# Altium schematic sheet CONNECTORS.SchDoc
size A3; Organization: Electronic Research & Design; Address1: 11 Granofier; Address2: Zwartkop; Address3: Centurion; Address4: South Africa; ProjectName: Flir
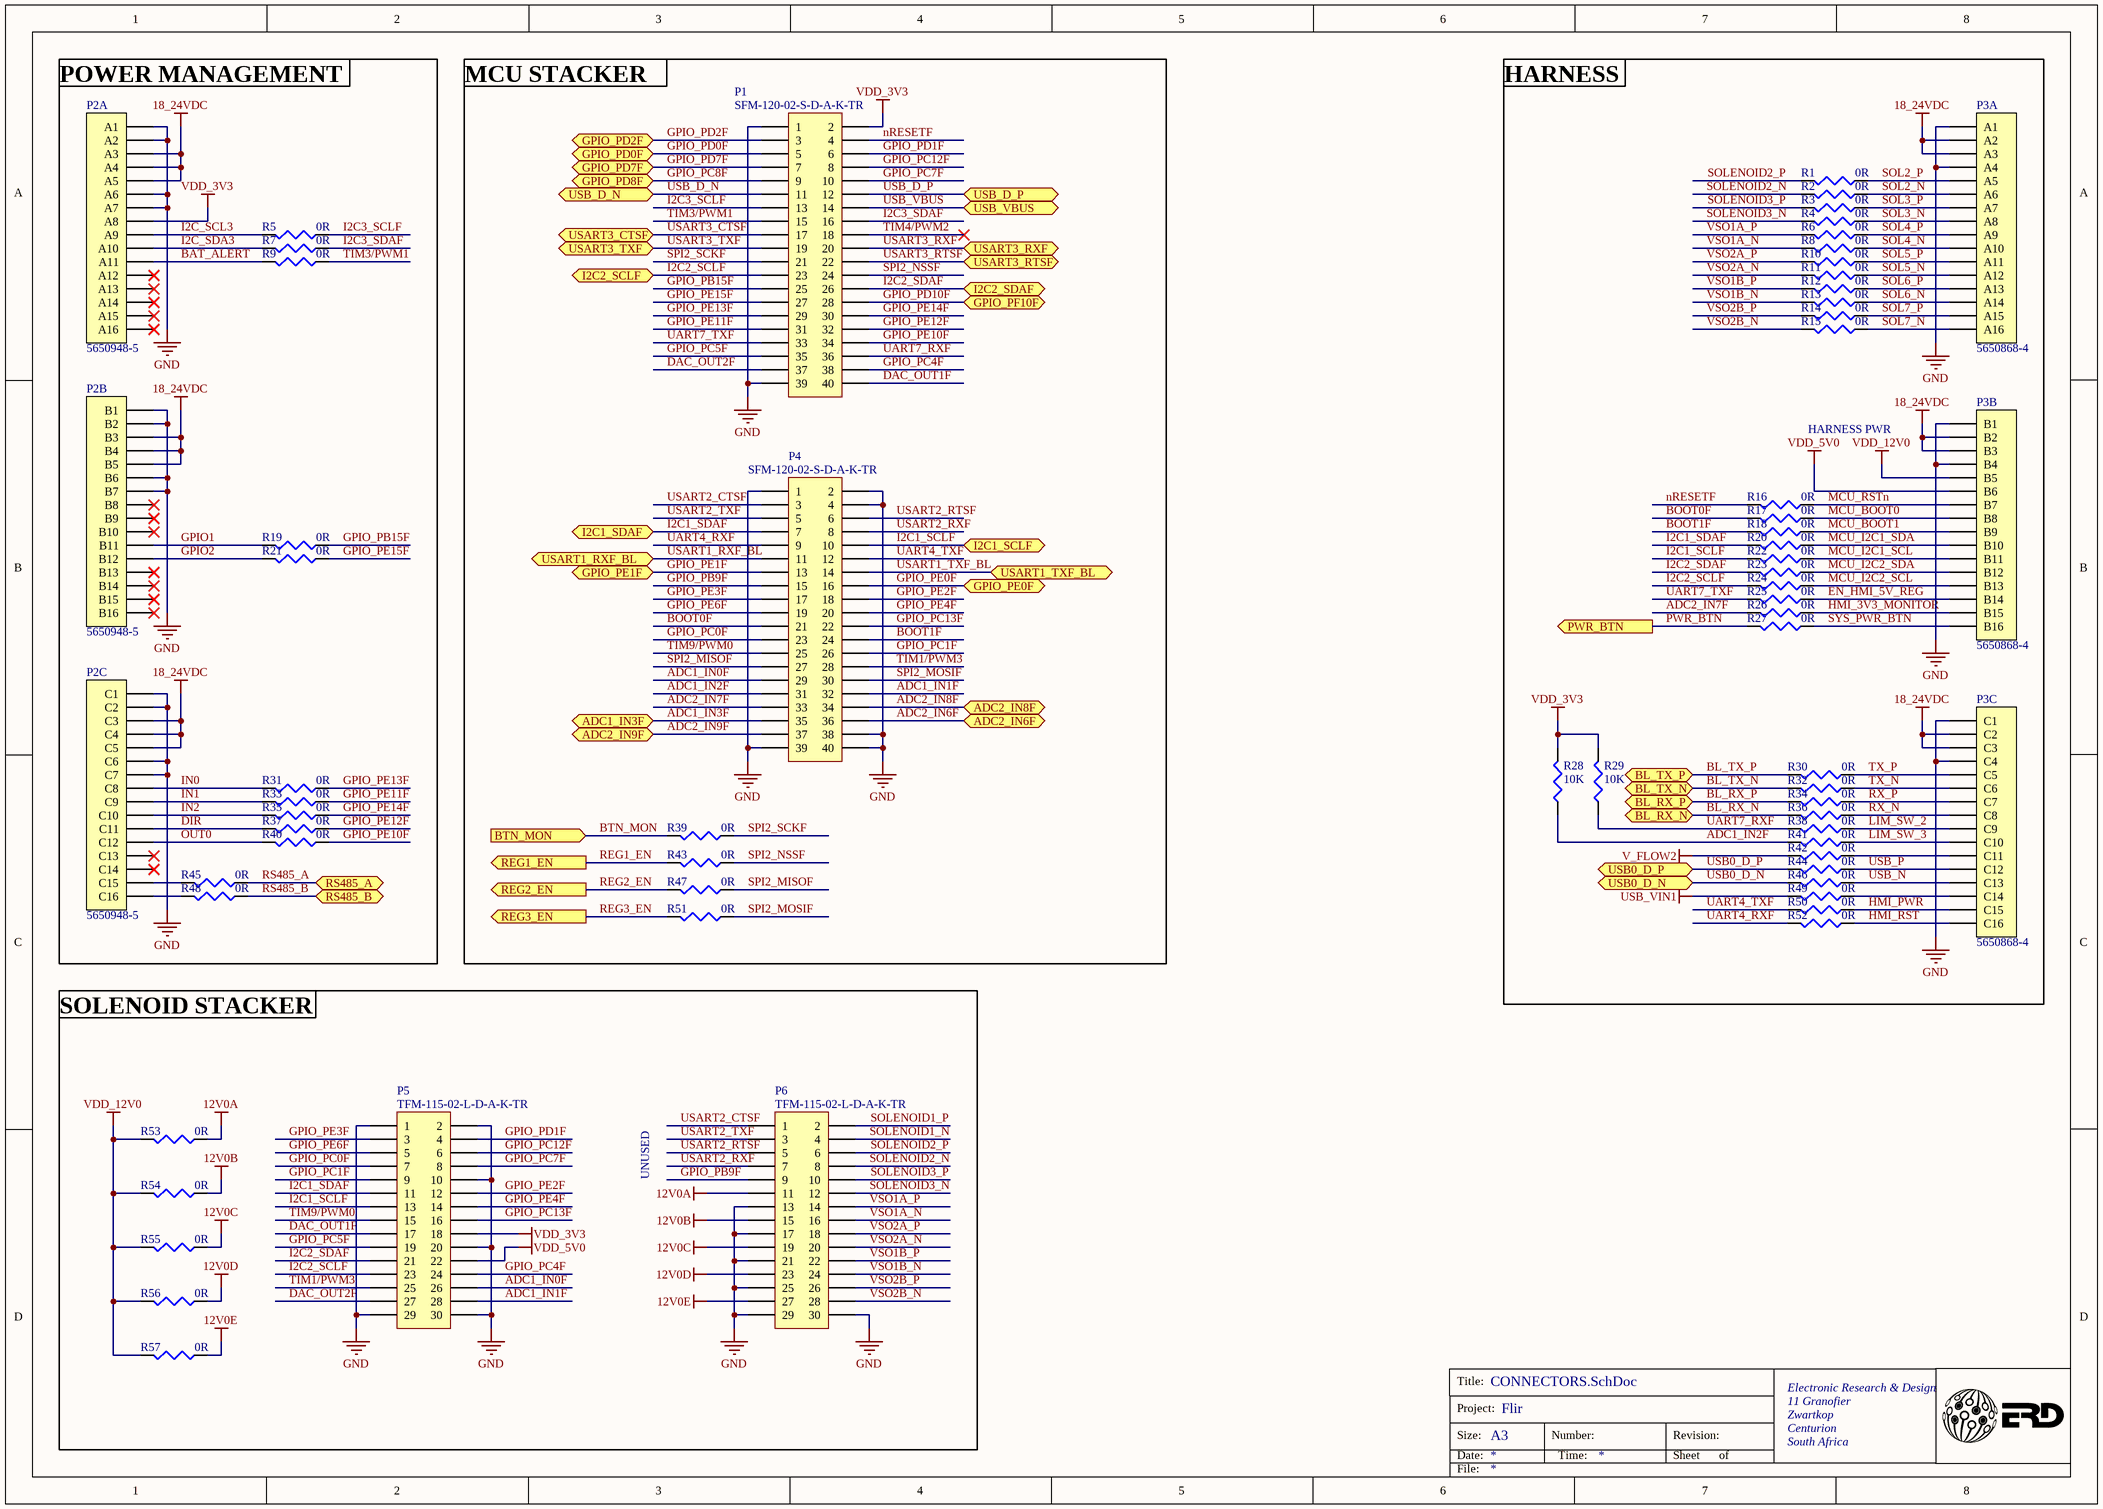
[diagram p0: CONNECTORS.SchDoc]

## Parts
P1  SFM-120-02-S-D-A-K-TR  [SFM-120-02-S-D-A-K-TR]
P2  5650948-5  [5650948-5_M_RA]  (parts A,B,C of 3)
P3  5650868-4  [5650868-4_F_RA]  (parts A,B,C of 3)
P4  SFM-120-02-S-D-A-K-TR  [SFM-120-02-S-D-A-K-TR]
P5  TFM-115-02-L-D-A-K-TR  [SFM-115-02-L-D-A-K-TR]
P6  TFM-115-02-L-D-A-K-TR  [SFM-115-02-L-D-A-K-TR]
R1  0R  [RC0402]
R2  0R  [RC0402]
R3  0R  [RC0402]
R4  0R  [RC0402]
R5  0R  [RC0402]
R6  0R  [RC0402]
R7  0R  [RC0402]
R8  0R  [RC0402]
R9  0R  [RC0402]
R10  0R  [RC0402]
R11  0R  [RC0402]
R12  0R  [RC0402]
R13  0R  [RC0402]
R14  0R  [RC0402]
R15  0R  [RC0402]
R16  0R  [RC0402]
R17  0R  [RC0402]
R18  0R  [RC0402]
R19  0R  [RC0402]
R20  0R  [RC0402]
R21  0R  [RC0402]
R22  0R  [RC0402]
R23  0R  [RC0402]
R24  0R  [RC0402]
R25  0R  [RC0402]
R26  0R  [RC0402]
R27  0R  [RC0402]
R28  10K  [RC0402]
R29  10K  [RC0402]
R30  0R  [RC0402]
R31  0R  [RC0402]
R32  0R  [RC0402]
R33  0R  [RC0402]
R34  0R  [RC0402]
R35  0R  [RC0402]
R36  0R  [RC0402]
R37  0R  [RC0402]
R38  0R  [RC0402]
R39  0R  [RC0402]
R40  0R  [RC0402]
R41  0R  [RC0402]
R42  0R  [RC0402]
R43  0R  [RC0402]
R44  0R  [RC0402]
R45  0R  [RC0402]
R46  0R  [RC0402]
R47  0R  [RC0402]
R48  0R  [RC0402]
R49  0R  [RC0402]
R50  0R  [RC0402]
R51  0R  [RC0402]
R52  0R  [RC0402]
R53  0R  [RC0603]
R54  0R  [RC0603]
R55  0R  [RC0603]
R56  0R  [RC0603]
R57  0R  [RC0603]

## Blocks framed on the sheet
HARNESS PWR: P3 R1-R4 R6 R8 R10-R18 R20 R22-R30 R32 R34 R36 R38 R41 R42 R44 R46 R49 R50 R52
UNUSED: P5 P6 R53-R57

## Ports
ADC1_IN3F, ADC2_IN6F, ADC2_IN8F, ADC2_IN9F, BL_RX_N (bidir), BL_RX_P (bidir), BL_TX_N (bidir), BL_TX_P (bidir), BTN_MON (in), GPIO_PD0F, GPIO_PD2F, GPIO_PD7F, GPIO_PD8F, GPIO_PE0F, GPIO_PE1F, GPIO_PF10F, I2C1_SCLF, I2C1_SDAF, I2C2_SCLF, I2C2_SDAF, PWR_BTN (out), REG1_EN (out), REG2_EN (out), REG3_EN (out), RS485_A (bidir), RS485_B (bidir), USART1_RXF_BL, USART1_TXF_BL, USART3_CTSF, USART3_RTSF, USART3_RXF, USART3_TXF, USB0_D_N (bidir), USB0_D_P (bidir), USB_D_N (bidir), USB_D_P (bidir), USB_VBUS (bidir)

## Nets
12V0A: P6.11 R53.1
12V0B: P6.15 R54.1
12V0C: P6.19 R55.1
12V0D: P6.23 R56.1
12V0E: P6.27 R57.1
18_24VDC: P2.3(A3) P2.4(A4) P2.5(A5) P2.19(B3) P2.20(B4) P2.21(B5) P2.35(C3) P2.36(C4) P2.37(C5) P3.2(A2) P3.3(A3) P3.18(B2) P3.19(B3) P3.34(C2) P3.35(C3)
GND: P1.1 P1.39 P2.1(A1) P2.2(A2) P2.6(A6) P2.7(A7) P2.17(B1) P2.18(B2) P2.22(B6) P2.23(B7) P2.33(C1) P2.34(C2) P2.38(C6) P2.39(C7) P3.1(A1) P3.4(A4) P3.17(B1) P3.20(B4) P3.33(C1) P3.36(C4) P4.1 P4.2 P4.4 P4.38 P4.39 P4.40 P5.1 P5.2 P5.10 P5.20 P5.29 P5.30 P6.13 P6.17 P6.21 P6.25 P6.29 P6.30
USB_VIN1: R49.2
V_FLOW2: R42.2
VDD_3V3: P1.2 P2.8(A8) P5.18 R28.2 R29.2
VDD_5V0: P3.22(B6) P5.22
VDD_12V0: P3.21(B5) R53.2 R54.2 R55.2 R56.2 R57.2
ADC1_IN0F: P4.29 P5.26
ADC1_IN1F: P4.32 P5.28
ADC1_IN2F: P4.31 R28.1 R41.2
ADC1_IN3F: P4.35 ; port ADC1_IN3F
ADC2_IN6F: P4.36 ; port ADC2_IN6F
ADC2_IN7F: P4.33 R26.2
ADC2_IN8F: P4.34 ; port ADC2_IN8F
ADC2_IN9F: P4.37 ; port ADC2_IN9F
BAT_ALERT: P2.11(A11) R9.2
BL_RX_N: R36.2 ; port BL_RX_N
BL_RX_P: R34.2 ; port BL_RX_P
BL_TX_N: R32.2 ; port BL_TX_N
BL_TX_P: R30.2 ; port BL_TX_P
BOOT0F: P4.21 R17.2
BOOT1F: P4.24 R18.2
BTN_MON: R39.2 ; port BTN_MON
DAC_OUT1F: P1.40 P5.17
DAC_OUT2F: P1.37 P5.27
DIR: P2.43(C11) R37.2
EN_HMI_5V_REG: P3.30(B14) R25.1
GPIO1: P2.27(B11) R19.2
GPIO2: P2.28(B12) R21.2
GPIO_PB9F: P4.15 P6.9
GPIO_PB15F: P1.25 R19.1
GPIO_PC0F: P4.23 P5.7
GPIO_PC1F: P4.26 P5.9
GPIO_PC4F: P1.38 P5.24
GPIO_PC5F: P1.35 P5.19
GPIO_PC7F: P1.10 P5.8
GPIO_PC8F: P1.9 ; port GPIO_PD8F
GPIO_PC12F: P1.8 P5.6
GPIO_PC13F: P4.22 P5.16
GPIO_PD0F: P1.5 ; port GPIO_PD0F
GPIO_PD1F: P1.6 P5.4
GPIO_PD2F: P1.3 ; port GPIO_PD2F
GPIO_PD7F: P1.7 ; port GPIO_PD7F
GPIO_PD10F: P1.28 ; port GPIO_PF10F
GPIO_PE0F: P4.16 ; port GPIO_PE0F
GPIO_PE1F: P4.13 ; port GPIO_PE1F
GPIO_PE2F: P4.18 P5.12
GPIO_PE3F: P4.17 P5.3
GPIO_PE4F: P4.20 P5.14
GPIO_PE6F: P4.19 P5.5
GPIO_PE10F: P1.34 R40.1
GPIO_PE11F: P1.31 R33.1
GPIO_PE12F: P1.32 R37.1
GPIO_PE13F: P1.29 R31.1
GPIO_PE14F: P1.30 R35.1
GPIO_PE15F: P1.27 R21.1
HMI_3V3_MONITOR: P3.31(B15) R26.1
HMI_PWR: P3.47(C15) R50.1
HMI_RST: P3.48(C16) R52.1
I2C1_SCLF: P4.10 P5.13 R22.2 ; port I2C1_SCLF
I2C1_SDAF: P4.7 P5.11 R20.2 ; port I2C1_SDAF
I2C2_SCLF: P1.23 P5.23 R24.2 ; port I2C2_SCLF
I2C2_SDAF: P1.26 P5.21 R23.2 ; port I2C2_SDAF
I2C3_SCLF: P1.13 R5.1
I2C3_SDAF: P1.16 R7.1
I2C_SCL3: P2.9(A9) R5.2
I2C_SDA3: P2.10(A10) R7.2
IN0: P2.40(C8) R31.2
IN1: P2.41(C9) R33.2
IN2: P2.42(C10) R35.2
LIM_SW_2: P3.41(C9) R38.1
LIM_SW_3: P3.42(C10) R41.1
MCU_BOOT0: P3.24(B8) R17.1
MCU_BOOT1: P3.25(B9) R18.1
MCU_I2C1_SCL: P3.27(B11) R22.1
MCU_I2C1_SDA: P3.26(B10) R20.1
MCU_I2C2_SCL: P3.29(B13) R24.1
MCU_I2C2_SDA: P3.28(B12) R23.1
MCU_RSTn: P3.23(B7) R16.1
nRESETF: P1.4 R16.2
OUT0: P2.44(C12) R40.2
PWR_BTN: R27.2 ; port PWR_BTN
REG1_EN: R43.2 ; port REG1_EN
REG2_EN: R47.2 ; port REG2_EN
REG3_EN: R51.2 ; port REG3_EN
RS485_A: R45.1 ; port RS485_A
RS485_B: R48.1 ; port RS485_B
RX_N: P3.40(C8) R36.1
RX_P: P3.39(C7) R34.1
SOL2_N: P3.6(A6) R2.1
SOL2_P: P3.5(A5) R1.1
SOL3_N: P3.8(A8) R4.1
SOL3_P: P3.7(A7) R3.1
SOL4_N: P3.10(A10) R8.1
SOL4_P: P3.9(A9) R6.1
SOL5_N: P3.12(A12) R11.1
SOL5_P: P3.11(A11) R10.1
SOL6_N: P3.14(A14) R13.1
SOL6_P: P3.13(A13) R12.1
SOL7_N: P3.16(A16) R15.1
SOL7_P: P3.15(A15) R14.1
SOLENOID1_N: P6.4
SOLENOID1_P: P6.2
SOLENOID2_N: P6.8 R2.2
SOLENOID2_P: P6.6 R1.2
SOLENOID3_N: P6.12 R4.2
SOLENOID3_P: P6.10 R3.2
SPI2_MISOF: P4.27 R47.1
SPI2_MOSIF: P4.30 R51.1
SPI2_NSSF: P1.24 R43.1
SPI2_SCKF: P1.21 R39.1
SYS_PWR_BTN: P3.32(B16) R27.1
TIM1/PWM3: P4.28 P5.25
TIM3/PWM1: P1.15 R9.1
TIM4/PWM2: P1.18
TIM9/PWM0: P4.25 P5.15
TX_N: P3.38(C6) R32.1
TX_P: P3.37(C5) R30.1
UART4_RXF: P4.9 R52.2
UART4_TXF: P4.12 R50.2
UART7_RXF: P1.36 R29.1 R38.2
UART7_TXF: P1.33 R25.2
USART1_RXF_BL: P4.11 ; port USART1_RXF_BL
USART1_TXF_BL: P4.14 ; port USART1_TXF_BL
USART2_CTSF: P4.3 P6.1
USART2_RTSF: P4.6 P6.5
USART2_RXF: P4.8 P6.7
USART2_TXF: P4.5 P6.3
USART3_CTSF: P1.17 ; port USART3_CTSF
USART3_RTSF: P1.22 ; port USART3_RTSF
USART3_RXF: P1.20 ; port USART3_RXF
USART3_TXF: P1.19 ; port USART3_TXF
USB0_D_N: R46.2 ; port USB0_D_N
USB0_D_P: R44.2 ; port USB0_D_P
USB_D_N: P1.11 ; port USB_D_N
USB_D_P: P1.12 ; port USB_D_P
USB_N: P3.45(C13) R46.1
USB_P: P3.44(C12) R44.1
USB_VBUS: P1.14 ; port USB_VBUS
VSO1A_N: P6.16 R8.2
VSO1A_P: P6.14 R6.2
VSO1B_N: P6.24 R13.2
VSO1B_P: P6.22 R12.2
VSO2A_N: P6.20 R11.2
VSO2A_P: P6.18 R10.2
VSO2B_N: P6.28 R15.2
VSO2B_P: P6.26 R14.2
NetP2_47: P2.47(C15) R45.2
NetP2_48: P2.48(C16) R48.2
NetP3_43: P3.43(C11) R42.1
NetP3_46: P3.46(C14) R49.1

Not connected (* = marked no-connect by the designer): P2 12(A12)* 13(A13)* 14(A14)* 15(A15)* 16(A16)* 24(B8)* 25(B9)* 26(B10)* 29(B13)* 30(B14)* 31(B15)* 32(B16)* 45(C13)* 46(C14)*

## Notes on the sheet
- (near P2) POWER MANAGEMENT
- MCU STACKER
- HARNESS
- SOLENOID STACKER
- Title:
- Size:
- Date:
- Project:
- A3
- Number:
- Time:
- Revision:
- Sheet
- of
- File:

## Library data of the parts
P1 P4 = Header 20X2: Receptacle, 40 POS, 1.27mm PITCH, SMD; PartNumber: SFM-120-02-S-D-A-K-TR
P2 = DIN_41612_3x16: DIN-41612, C/2, 48-circuit, 3x16, 2.54mm pitch, RA, TH; Manufacturer: TE Connectivity; PartNumber: 5650948-5
P3 = DIN_41612_3x16: DIN-41612, R/2, 48-circuit, 3x16, 2.54mm pitch, RA, TH; Manufacturer: TE Connectivity; PartNumber: 5650868-4
P5 P6 = Header 15X2: Header, 30 POS, 1.27mm PITCH, SMD; PartNumber: TFM-115-02-L-D-A-K-TR
R1-R27 R30-R52 = RES_10K_1/16W_1%_0402: RES, 0 OHM, 1/16W, 1%, 0402; Manufacturer: Yageo; PartNumber: RC0402FR-070RL; Package / Case: 0402 (1005 Metric); Supplier: AAD
R28 R29 = RES_10K_1/16W_1%_0402: RES, 10K OHM, 1/16W, 1%, 0402; Manufacturer: Yageo; Part Number: RC0402FR-0710KL; Package / Case: 0402 (1005 Metric); Supplier: AAD
R53-R57 = RES_10K_1/16W_1%_0402: RES, 0 OHM, 1/10W, 50mOhm (5%), 0603; Manufacturer: Yageo; PartNumber: RC0603JR-070RP; Package / Case: 0603 (1608 Metric)